# EAGLE design pt_100 _2 (EAGLE 9.6.2)
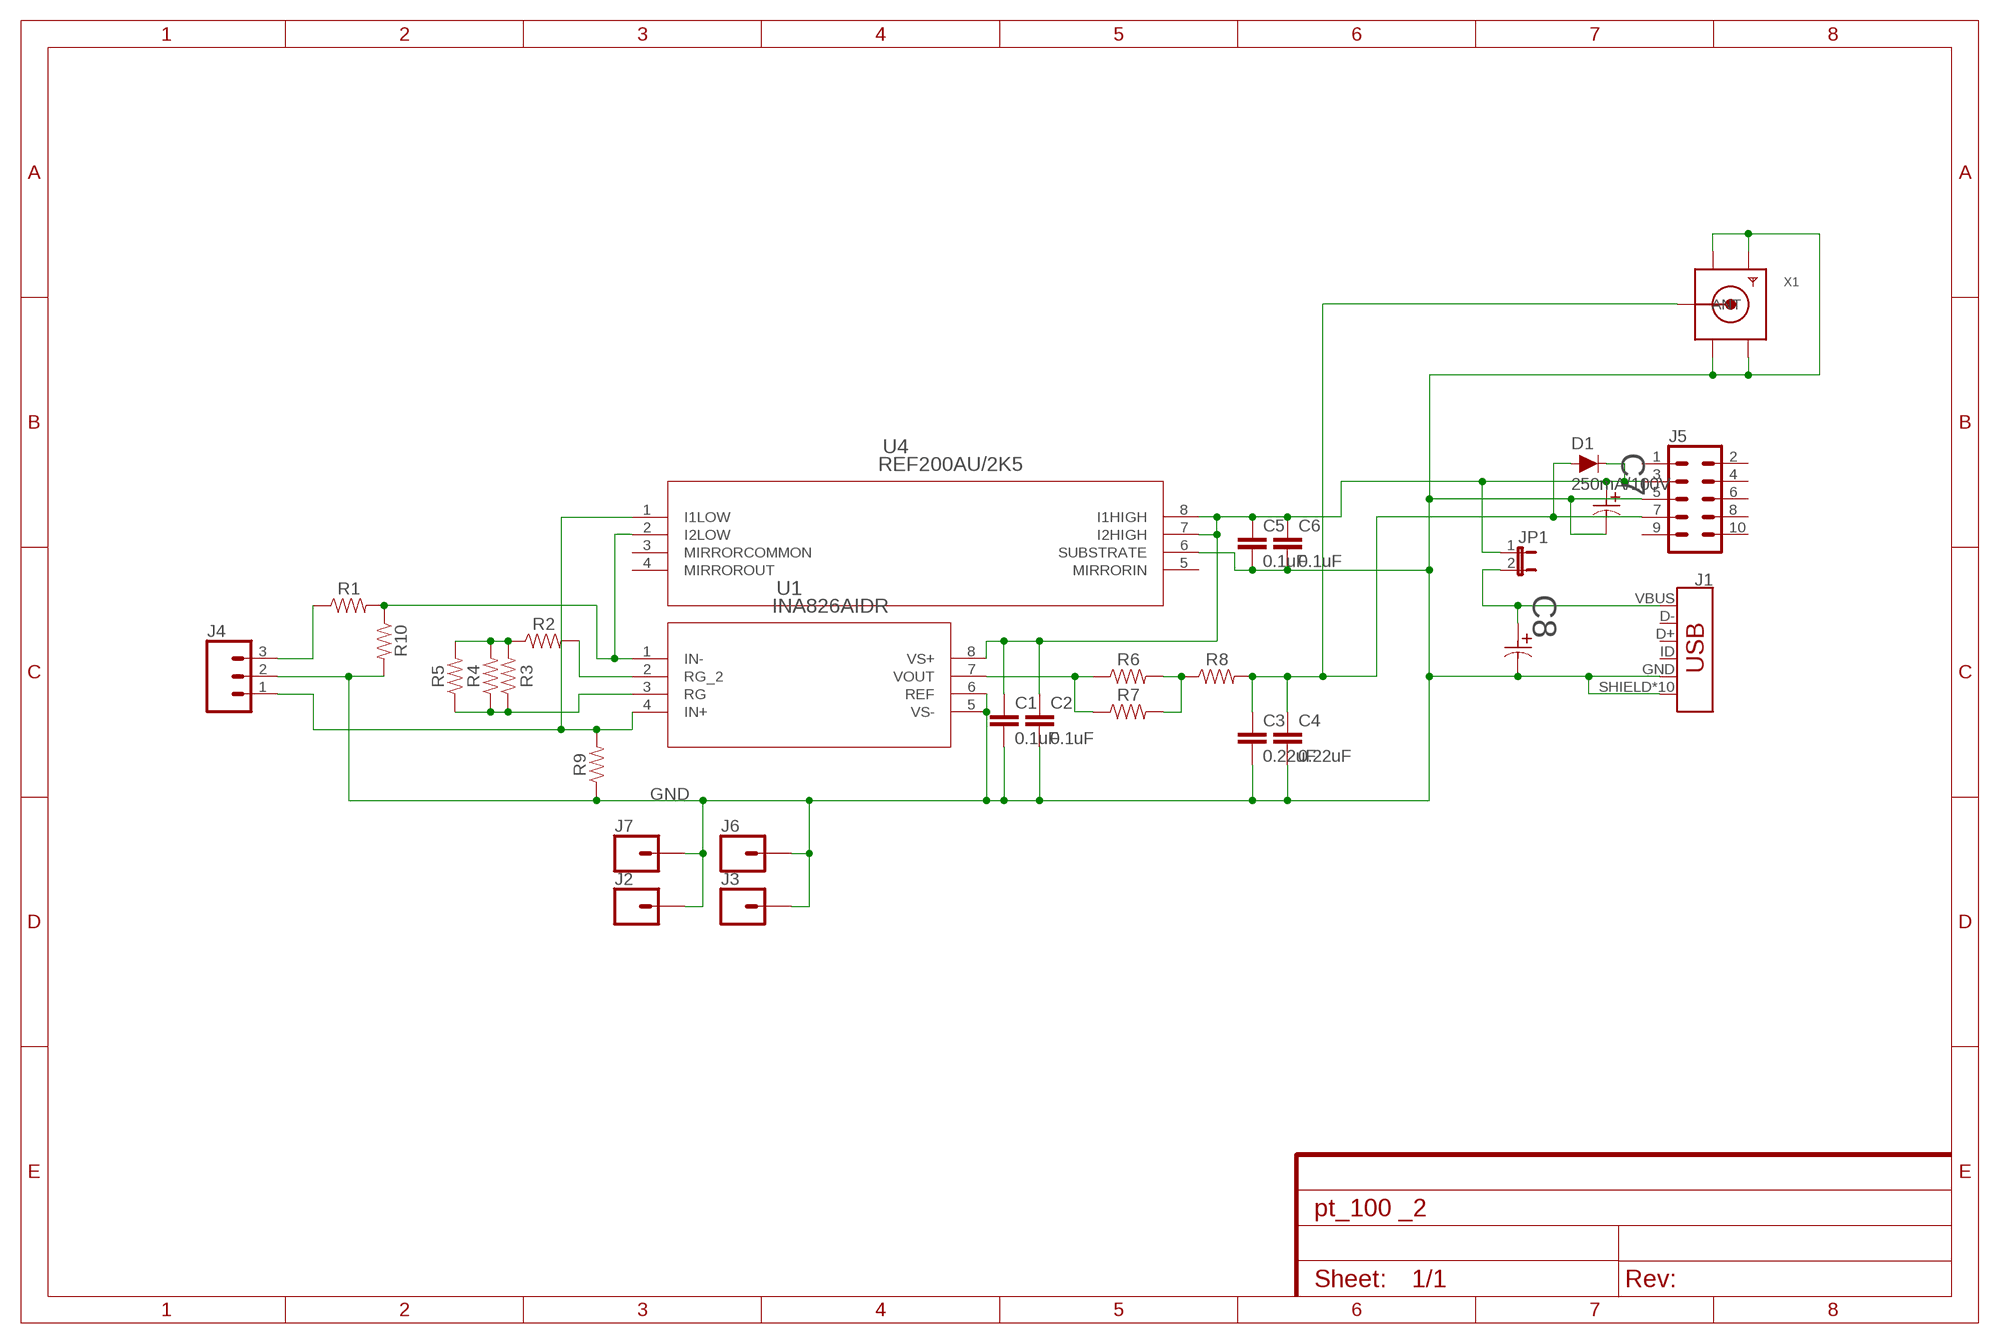
[diagram p0: schematic, sheet 1]

## Parts
C1  0.1uF  0.1UF-0402-6.3V-10%-X7R  [0402]
C2  0.1uF  0.1UF-0402-6.3V-10%-X7R  [0402]
C3  0.22uF  0.1UF-0402-6.3V-10%-X7R  [0402]
C4  0.22uF  0.1UF-0402-6.3V-10%-X7R  [0402]
C5  0.1uF  0.1UF-0402-6.3V-10%-X7R  [0402]
C6  0.1uF  0.1UF-0402-6.3V-10%-X7R  [0402]
C7  T491D106K025AT  [CAPMP7.6X4.3_3.1N_KEM]
C8  T491D106K025AT  [CAPMP7.6X4.3_3.1N_KEM]
D1  250mA/100V  DIODE-BAS16J  [SOD-323]
J1  USB_MICRO-B_HALF_PTH_MILL  [USB-MICROB-PTH-MILL]
J2  CONN_01  [1X01]
J3  CONN_01  [1X01]
J4  CONN_03-SCREW-5MM  [SCREWTERMINAL-5MM-3]
J5  CONN_05X2SHD_LOCK  [2X5-SHROUDED_LOCK]
J6  CONN_01  [1X01]
J7  CONN_01  [1X01]
JP1  JUMPER-2PTH  [1X02]
R1  82  1KOHM-0402-1/16W-1%  [0402]
R2  0  1KOHM-0402-1/16W-1%  [0402]
R3  75  1KOHM-0402-1/16W-1%  [0402]
R4  75  1KOHM-0402-1/16W-1%  [0402]
R5  75  1KOHM-0402-1/16W-1%  [0402]
R6  75  1KOHM-0402-1/16W-1%  [0402]
R7  1KOHM-0402-1/16W-1%  [0402]
R8  0  1KOHM-0402-1/16W-1%  [0402]
R9  1KOHM-0402-1/16W-1%  [0402]
R10  1KOHM-0402-1/16W-1%  [0402]
U1  INA826AIDR  [D8]
U4  REF200AU/2K5  [D8]
X1  SMACONNECTOR_EDGE  [SMA_EDGELAUNCH]

## Nets
GND: C1.2 C2.2 C3.2 C4.2 C5.2 C6.2 C7.2 C8.2 J1.GND J1.SHIELD J1.SHIELD2(SHIELD) J1.SHIELD3(SHIELD) J1.SHIELD4(SHIELD) J1.SHIELD5(SHIELD) J1.SHIELD6(SHIELD) J1.SHIELD7(SHIELD) J1.SHIELD8(SHIELD) J1.SHIELD9(SHIELD) J1.SHIELD10(SHIELD) J2.1 J3.1 J4.2 J5.5 J6.1 J7.1 R9.1 R10.2 U1.5(VS-) U1.6(REF) U4.6(SUBSTRATE) X1.GND@1(GND4) X1.GND@2(GND3) X1.GND@3(GND2) X1.GND@4(GND1)
N$1: C8.1 J1.VBUS JP1.2
N$2: J4.3 R1.1
N$3: R1.2 R10.1 U1.1(IN-) U4.2(I2LOW)
N$5: R6.2 R7.2 R8.1
N$7: R6.1 R7.1 U1.7(VOUT)
N$8: R2.2 U1.2(RG_2)
N$9: R3.1 R4.1 R5.1 U1.3(RG)
N$10: J4.1 R9.2 U1.4(IN+) U4.1(I1LOW)
N$11: C3.1 C4.1 D1.A J5.7 R8.2 X1.P(ANT)
N$12: R2.1 R3.2 R4.2 R5.2
N$13: C1.1 C2.1 C5.1 C6.1 C7.1 D1.C J5.3 JP1.1 U1.8(VS+) U4.7(I2HIGH) U4.8(I1HIGH)
Unconnected: J1.D+ J1.D- J1.ID J5.1 J5.2 J5.4 J5.6 J5.8 J5.9 J5.10 U4.3(MIRRORCOMMON) U4.4(MIRROROUT) U4.5(MIRRORIN)

## Library data of the parts
C1 C5 C6 = SparkFun-Capacitors:0.1UF: 0.1µF ceramic capacitors A capacitor is a passive two-terminal electrical component used to store electrical energy temporarily in an electric field.; PROD_ID: CAP-14993
C2 = SparkFun-Capacitors:0.1UF: 0.1µF ceramic capacitors A capacitor is a passive two-terminal electrical component used to store electrical energy temporarily in an electric field.; PROD_ID: CAP-14993; SPICEPREFIX: C
C3 C4 = SparkFun-Capacitors:0.1UF: 0.1µF ceramic capacitors A capacitor is a passive two-terminal electrical component used to store electrical energy temporarily in an electric field.; PROD_ID: CAP-14993; VALUE: 0.1uF
C7 C8 = kemet_10uf:T491D106K025AT; BUILT_BY: EMA_Frank; MANUFACTURER_PART_NUMBER: T491D106K025AT; SOURCELIBRARY: Kemet_2020-03-25_3; SOURCE_LIBRARY: Kemet_2020-03-25_3.xlr; VENDOR: Kemet
D1 = SparkFun-DiscreteSemi:DIODE: Diode These are standard reverse protection diodes and small signal diodes. SparkFun Products: SparkFun SparkPunk Sound Kit <https://www.sparkfun.com/products/11177> SparkFun ESP8266 Thing <https://www.sparkfun.com/products/13231>; PROD_ID: DIO-09646
J1 = SparkFun-Connectors:USB_MICRO-B: USB Type Micro-B Connector Male/female and PTH/SMT variants SparkFun Products: SparkFun microB USB Breakout <https://www.sparkfun.com/products/12035> SparkFun USB microB Plug Breakout <https://www.sparkfun.com/products/10031> SparkFun ESP8266 Thing <https://www.sparkfun.com/products/13231>; PROD_ID: CONN-13711
J2 J3 J6 J7 = SparkFun-Connectors:CONN_01: Single connection point. Often used as Generic Header-pin footprint for 0.1 inch spaced/style header connections On any of the 0.1 inch spaced packages, you can populate with these: Break Away Headers - Straight <https://www.sparkfun.com/products/116> (PRT-00116) Break Away Male Headers - Right Angle <https://www.sparkfun.com/products/553> (PRT-00553) Female Headers <https://www.sparkfun.com/products/115> (PRT-00115) Break Away Headers - Machine Pin <https://www.sparkfun.com/products/117> (PRT-00117) Break Away Female Headers - Swiss Machine Pin <https://www.sparkfun.com/products/743> (PRT-00743) This device is also useful as a general connection point to wire up your design to another part of your project. Our various solder wires solder well into these plated through hole pads. Hook-Up Wire - Assortment (Stranded, 22 AWG) <https://www.sparkfun.com/products/11375> (PRT-11375) Hook-Up Wire - Assortment (Solid Core, 22 AWG) <https://www.sparkfun.com/products/11367> (PRT-11367) View the entire wire category on our website here <https://www.sparkfun.com/categories/141> Special notes: SMTSO-256-ET is a "flush mount" nut for a 4-40 screw. We mostly use this on specialty testbeds; it is a nice way to connect hardware to your PCB at an adjustable hieght. Also note, the SNAP packages are for using a snappable style connector. We sell a baggie of snaps and they are also used on two LilyPad designs: Snap Assortment - 30 pack (male and female) <https://www.sparkfun.com/products/11347> (DEV-11347) LilyPad Arduino SimpleSnap <https://www.sparkfun.com/products/10941> (DEV-10941) LilyPad SimpleSnap Protoboard <https://www.sparkfun.com/products/10940> (DEV-10940)
J4 = SparkFun-Connectors:CONN_03: Multi connection point. Often used as Generic Header-pin footprint for 0.1 inch spaced/style header connections On any of the 0.1 inch spaced packages, you can populate with these: Break Away Headers - Straight <https://www.sparkfun.com/products/116> (PRT-00116) Break Away Male Headers - Right Angle <https://www.sparkfun.com/products/553> (PRT-00553) Female Headers <https://www.sparkfun.com/products/115> (PRT-00115) Break Away Headers - Machine Pin <https://www.sparkfun.com/products/117> (PRT-00117) Break Away Female Headers - Swiss Machine Pin <https://www.sparkfun.com/products/743> (PRT-00743) Stackable Header - 3 Pin (Female, 0.1") <https://www.sparkfun.com/products/13875> (PRT-13875) For SCREWTERMINALS and SPRING TERMINALS visit here: Screw Terimnals on SparkFun.com <https://www.sparkfun.com/search/results?term=Screw+Terminals> (5mm/3.5mm/2.54mm spacing) This device is also useful as a general connection point to wire up your design to another part of your project. Our various solder wires solder well into these plated through hole pads. Hook-Up Wire - Assortment (Stranded, 22 AWG) <https://www.sparkfun.com/products/11375> (PRT-11375) Hook-Up Wire - Assortment (Solid Core, 22 AWG) <https://www.sparkfun.com/products/11367> (PRT-11367) View the entire wire category on our website here <https://www.sparkfun.com/categories/141> Special notes: Molex polarized connector foot print use with SKU : PRT-08232 with associated crimp pins and housings.; PROD_ID: CONN-10134; SF_SKU: PRT-08433
J5 = SparkFun-Connectors:CONN_05X2: Multi connection point. Often used as Generic Header-pin footprint for 0.1 inch spaced/style header connections For AVR SPI programming port, see special device with nice symbol: "AVR_SPI_PROG_5x2.dev" You can populate with any combo of single row headers, but if you'd like an exact match, check these: 2x5 AVR ICSP Male Header <https://www.sparkfun.com/products/778> (PRT-00778) 2x5 Pin Shrouded Header <https://www.sparkfun.com/products/8506> (PRT-08506) On any of the 0.1 inch spaced packages, you can populate with these: Break Away Headers - Straight <https://www.sparkfun.com/products/116> (PRT-00116) Break Away Male Headers - Right Angle <https://www.sparkfun.com/products/553> (PRT-00553) Female Headers <https://www.sparkfun.com/products/115> (PRT-00115) Break Away Headers - Machine Pin <https://www.sparkfun.com/products/117> (PRT-00117) Break Away Female Headers - Swiss Machine Pin <https://www.sparkfun.com/products/743> (PRT-00743) Special note: the shrouded connector mates well with our 5x2 ribbon cables: 2x5 Pin IDC Ribbon Cable <https://www.sparkfun.com/products/8535> (PRT-08535); PROD_ID: CONN-08671; SF_ID: PRT-08506
JP1 = SparkFun-Retired:JUMPER-2: Jumper Basic 0.1" spaced jumper. Use with breakaway headers.
R1-R10 = SparkFun-Resistors:1KOHM: 1kΩ resistor A resistor is a passive two-terminal electrical component that implements electrical resistance as a circuit element. Resistors act to reduce current flow, and, at the same time, act to lower voltage levels within circuits. - Wikipedia; PROD_ID: RES-14342
U1 = ina826_8pin:INA826AIDR; DATASHEET_URL: http://www.ti.com/lit/gpn/INA826; DESCRIPTION: Precision, 200-µA Supply Current, 36-V Supply Instrumentation Amplifier; FAMILY_NAME: SINGLE SUPPLY; GENERIC_PART_NUMBER: INA826; INDUSTRY_STD_PKG_TYPE: SOIC; MANUFACTURER: Texas Instruments; MANUFACTURER_PART_NUMBER: INA826AIDR; PACKAGE_DESIGNATOR: D; PIN_COUNT: 8; VENDOR: Texas Instruments
U4 = Ref200:REF200AU/2K5; DATASHEET_URL: http://www.ti.com/lit/gpn/REF200; DESCRIPTION: Dual Current Source/Current Sink; FAMILY_NAME: CURRENT REFERENCE; GENERIC_PART_NUMBER: REF200; INDUSTRY_STD_PKG_TYPE: SOIC; MANUFACTURER: Texas Instruments; MANUFACTURER_PART_NUMBER: REF200AU/2K5; PACKAGE_DESIGNATOR: D; PIN_COUNT: 8; VENDOR: Texas Instruments
X1 = adafruit:SMACONNECTOR: SMA Connector 90° DIP SMA Connector, 50 Ohm (4UConnector: 07259)

## Board
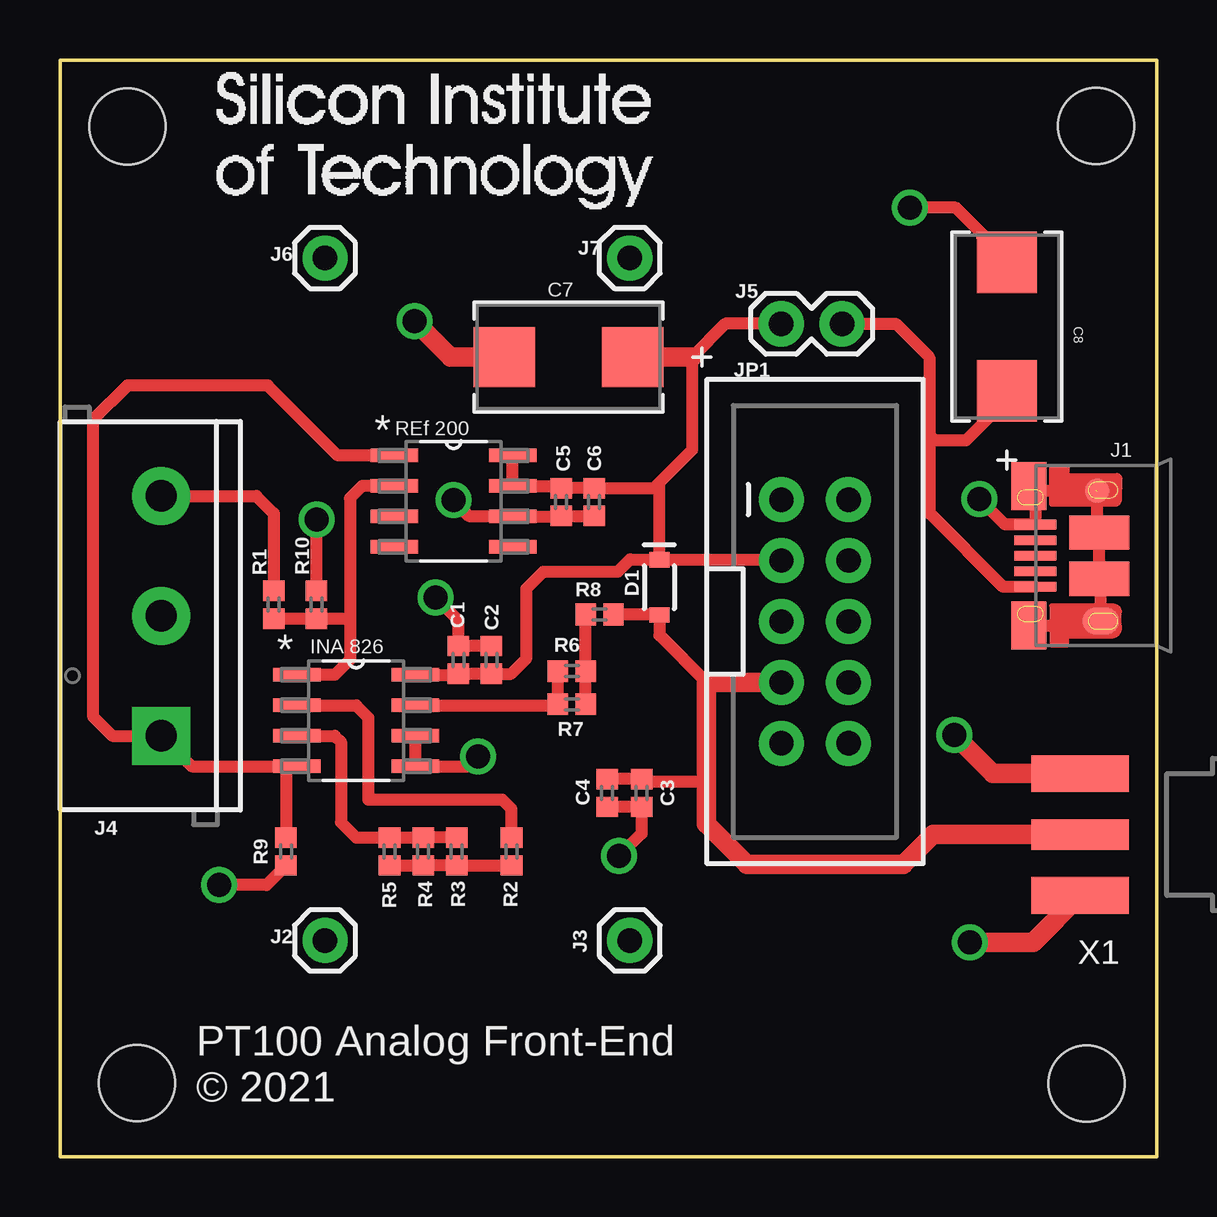
[diagram p1: board, top side]
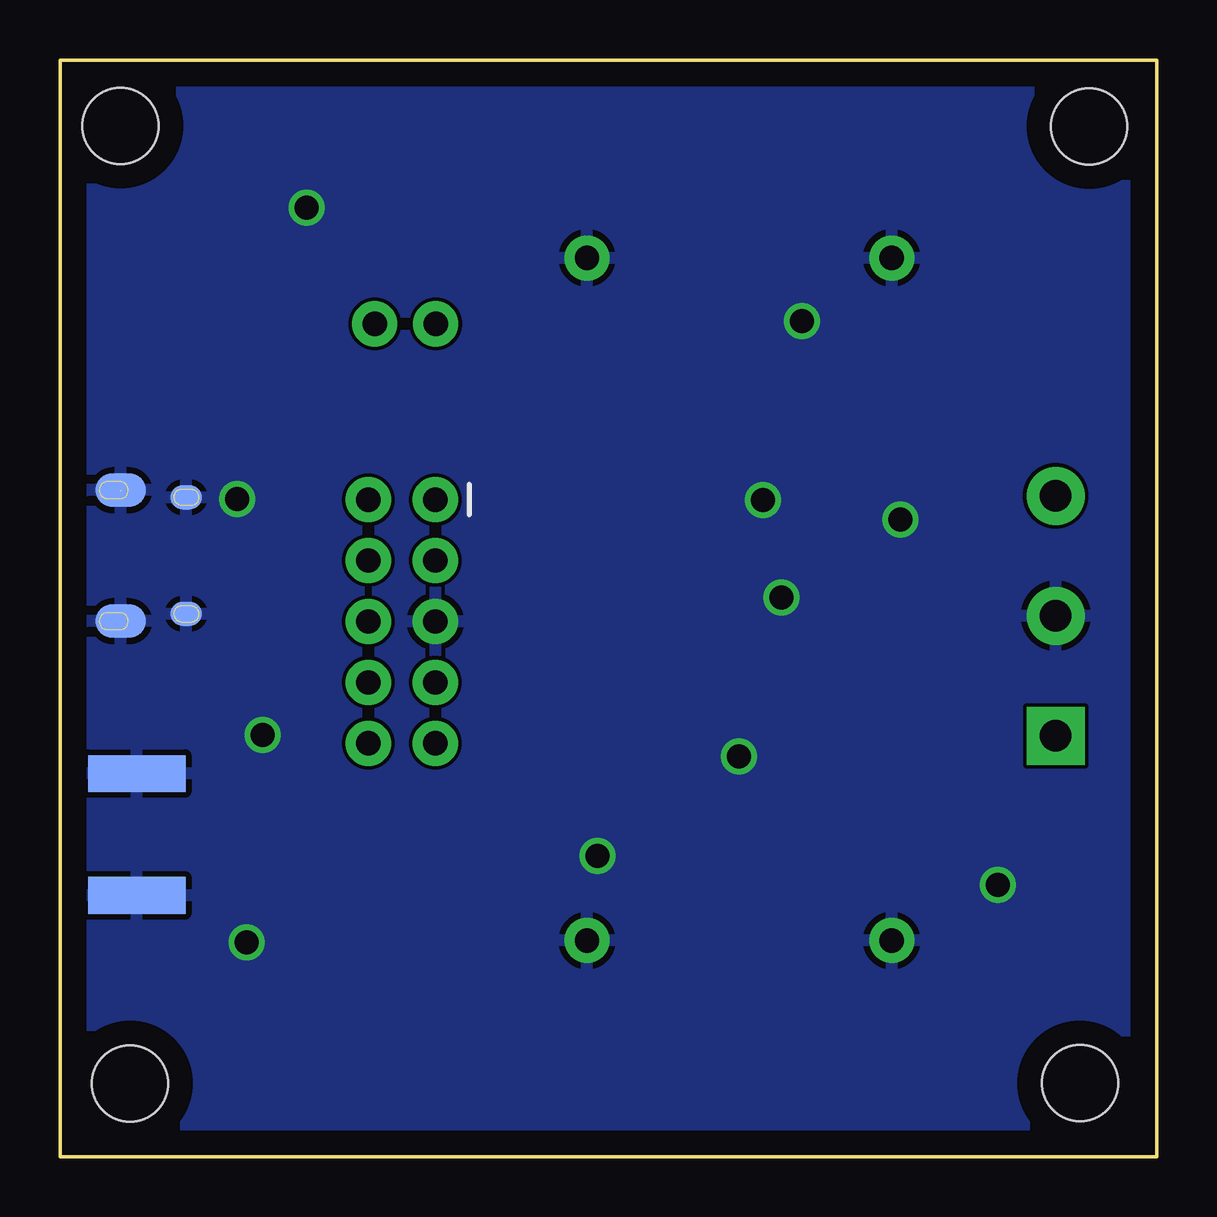
[diagram p2: board, bottom side, seen from below]

Size 45.72 x 45.72 mm. Coordinates in mm from the lower left corner, seen from the top.
Outline: 0,0 45.72,0 45.72,45.72 0,45.72 0,0
Copper layers (1*16): Top 0.035mm / dielectric 1.5mm / Bottom 0.035mm
Design rules "default": minimum track width 6mil, minimum drill 0.35mm, track to track 6mil, track to pad 6mil, pad to pad 6mil, via to via 6mil, smd to smd 6mil, copper to edge 40mil, drill to drill 6mil, minimum pad ring 10mil, minimum via ring 8mil, stop-mask expansion 4mil, vias tented up to drill 0mil, thermal gap 10mil
Holes 3.17 mm at 2.82,42.95 3.2,3.07 42.8,3.06 43.19,42.98

### Footprints (pad centres in the part's own frame; a part is rotated, then mirrored left to right if it is on the bottom)
0402 = smd 0.85 x 0.9: 1 -0.58,0; 2 0.58,0
CAPMP7.6X4.3_3.1N_KEM = smd 2.56 x 2.5: 1 -2.672,0; 2 2.672,0
SOD-323 = smd 0.63 x 0.83: A 1.15,0; C -1.15,0
USB-MICROB-PTH-MILL = smd 0.4 x 1.75: D+ 0,0; D- -0.65,0; GND 1.3,0; ID 0.65,0; VBUS -1.3,0 | smd 2 x 1.46: SHIELD -2.9,0.275; SHIELD2 2.9,0.275 | smd 1.425 x 2.5: SHIELD3 -0.963,-2.675; SHIELD4 0.963,-2.675 | smd 1.4 x 2.1 bottom: SHIELD5 -2.731,-2.531; SHIELD7 2.729,-2.531 | smd 1 x 1: SHIELD6 2.7,-2.575 | smd 1.1 x 1.5: SHIELD8 -2.731,-2.731 | smd 1 x 1.3 bottom: SHIELD9 -2.43,0.195; SHIELD10 2.43,0.195
1X01 = drill 1.016 pad 1.88: 1 0,0
SCREWTERMINAL-5MM-3 = drill 1.3 pad 2.413 square: 1 0,0 | drill 1.3 pad 2.413: 2 5,0; 3 10,0
2X5-SHROUDED_LOCK = drill 1.016 pad 1.88: 1 -1.397,5.08; 2 1.397,5.08; 3 -1.397,2.54; 4 1.397,2.54; 5 -1.397,0; 6 1.397,0; 7 -1.397,-2.54; 8 1.397,-2.54; 9 -1.397,-5.08; 10 1.397,-5.08
1X02 = drill 1.016 pad 1.88: 1 0,0; 2 2.54,0
D8 = smd 1.981 x 0.559: 1 -2.464,1.905; 2 -2.464,0.635; 3 -2.464,-0.635; 4 -2.464,-1.905; 5 2.464,-1.905; 6 2.464,-0.635; 7 2.464,0.635; 8 2.464,1.905
SMA_EDGELAUNCH = smd 4.064 x 1.524: GND@1 2.032,-2.54; GND@2 2.032,2.54 | smd 4.064 x 1.524 bottom: GND@3 2.032,2.54; GND@4 2.032,-2.54 | smd 4.064 x 1.27: P 2.032,0

### Placement (x,y rotation side)
C1  16.61,20.71 90 top
C2  17.98,20.71 90 top
C3  24.24,15.16 270 top
C4  22.81,15.16 270 top
C5  20.89,27.29 270 top
C6  22.26,27.29 270 top
C7  21.2,33.34 180 top
C8  39.47,34.61 90 top
D1  24.98,23.74 270 top
J1  40.65,25.06 90 top
J2  11.05,9.02 0 top
J3  23.75,9.02 90 top
J4  4.22,17.55 90 top
J5  31.47,22.31 0 top
J6  11.05,37.47 0 top
J7  23.75,37.47 0 top
JP1  30.06,34.72 0 top
R1  8.92,23.01 270 top
R2  18.82,12.73 90 top
R3  16.54,12.73 270 top
R4  15.14,12.73 270 top
R5  13.74,12.73 270 top
R6  21.34,20.24 0 top
R7  21.34,18.86 0 top
R8  22.49,22.61 0 top
R9  9.42,12.73 90 top
R10  10.69,23.01 90 top
U1  12.34,18.19 0 top
U4  16.41,27.33 0 top
X1  44.55,13.44 180 top

### Tracks (layer width: path | path; a pad name or v marks a point on that pad's centre or on a via)
GND  (via drill 1)  (1 unrouted)
  Top 0.508: U1.6 U1.5 17.02,16.28 v17.42,16.69 | 39.96,22.57 J1.SHIELD 43.22,22.16 J1.SHIELD8 43.38,24.04 J1.SHIELD3 43.33,25.4 | 43.33,25.4 J1.SHIELD4 | R9.1 8.61,11.33 v6.63,11.33 | R10.2 v10.69,26.57 | v16.41,27.37 17.08,26.7 U4.6 20.88,26.7 C5.2 C6.2 | C8.2 38.44,38.31 38.44,38.47 37.34,39.56 v35.43,39.56 | 43.33,27.34 42.91,27.76 40.58,27.76 J1.SHIELD2 40.65,27.68 J1.GND 39.39,26.36 v38.33,27.42 | J1.SHIELD6 43.23,25.5 43.33,25.4 | C2.2 C1.2 16.61,22.35 v15.65,23.32 | C4.2 C3.2 24.24,13.47 v23.3,12.54
  Top 0.813: X1.GND@3 40.56,8.94 v37.94,8.94 | X1.GND@4 38.89,15.98 v37.27,17.59 | C7.2 16.28,33.34 v14.78,34.84
  pour Bottom: 0.03,0.03 45.71,0.03 45.71,45.75 0.03,45.75
N$1
  Top 0.508: C8.1 39.47,31.56 37.77,29.86 36.47,29.86 36.23,30.1 | J1.VBUS 39.31,23.76 36.23,26.83 36.23,30.1 | JP1.2 34.84,34.72 36.23,33.33 36.23,30.1
N$2
  Top 0.508: J4.3 8.19,27.55 8.91,26.82 R1.1
N$3
  Top 0.508: R1.2 R10.1 12.09,22.43 | U4.2 12.6,27.96 12.09,27.46 12.09,22.43 | 12.09,22.43 12.09,20.73 11.46,20.09 U1.1
N$5
  Top 0.508: R8.1 R6.2 R7.2
N$7
  Top 0.508: U1.7 20.72,18.82 R7.1 R6.1
N$8
  Top 0.508: R2.2 18.82,14.5 18.44,14.88 12.85,14.88 12.85,18.31 12.34,18.82 U1.2
N$9
  Top 0.508: R3.1 R4.1 R5.1 12.34,13.3 11.71,13.94 11.71,17.3 11.46,17.55 U1.3
N$10
  Top 0.508: R9.2 9.42,16.28 U1.4 5.49,16.28 J4.1 2.18,17.55 1.37,18.36 1.37,30.71 2.82,32.16 8.66,32.16 11.58,29.23 U4.1
N$11
  Top 0.508: R8.2 24.96,22.61 D1.A 24.98,21.74 26.95,19.77 | C4.1 C3.1 24.37,15.62 26.95,15.62
  Top 0.813: X1.P 36.41,13.44 35.17,12.19 28.64,12.19 26.95,13.88 26.95,15.62 26.95,19.77 J5.7
N$12
  Top 0.508: R5.2 R4.2 R3.2 R2.1
N$13
  Top 0.508: J5.3 30.04,24.89 D1.C | JP1.1 27.72,34.72 26.34,33.34 26.35,33.34 26.35,29.46 24.97,28.08 | D1.C 24.96,24.91 23.76,24.91 23.25,24.4 20.16,24.4 19.44,23.69 19.44,20.78 18.8,20.13 C2.1 C1.1 16.57,20.09 U1.8 | 24.97,28.08 24.97,24.9 D1.C | U4.8 18.96,29.23 18.87,29.15 U4.7 20.8,27.96 C5.1 C6.1 24.76,27.87 24.97,28.08
  Top 0.813: C7.1 26.34,33.34

### Text on the board
tPlace: PT100 Analog Front-End / © 2021
tNames: REf 200 | INA 826